# EAGLE board eib-256 (EAGLE 8.3.2), part 1 of 2
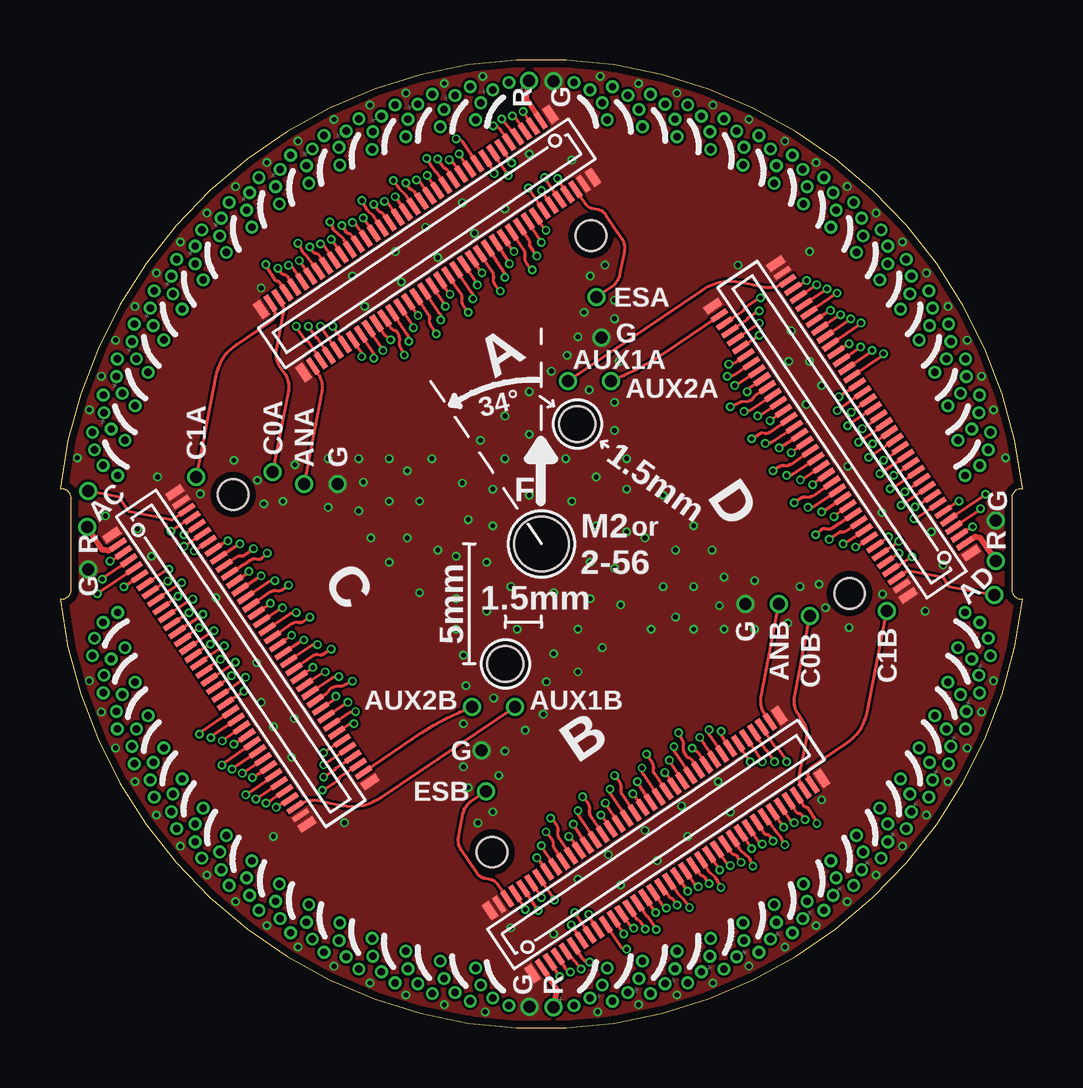
[diagram p1: board, top side]
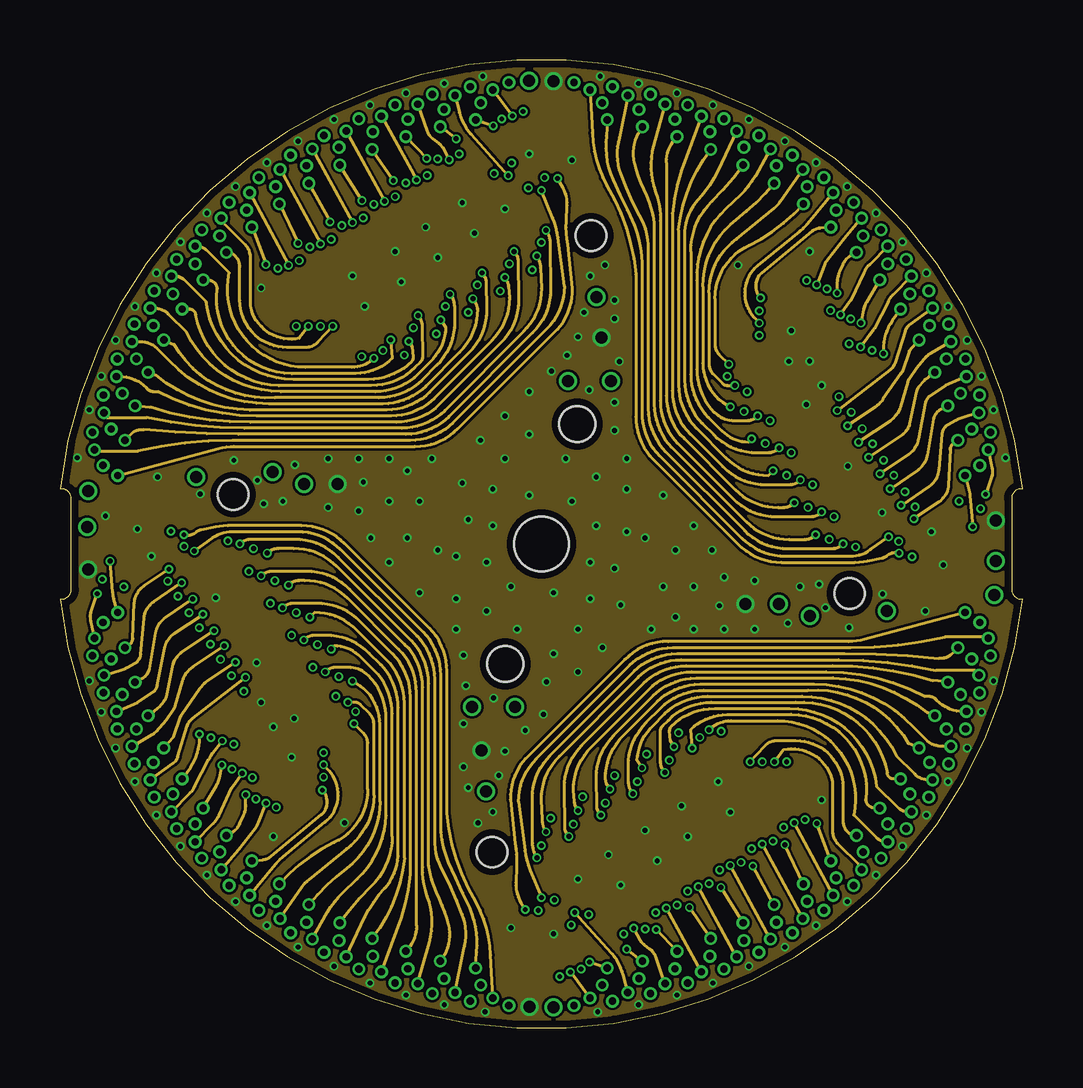
[diagram p2: board, inner layer Route2]
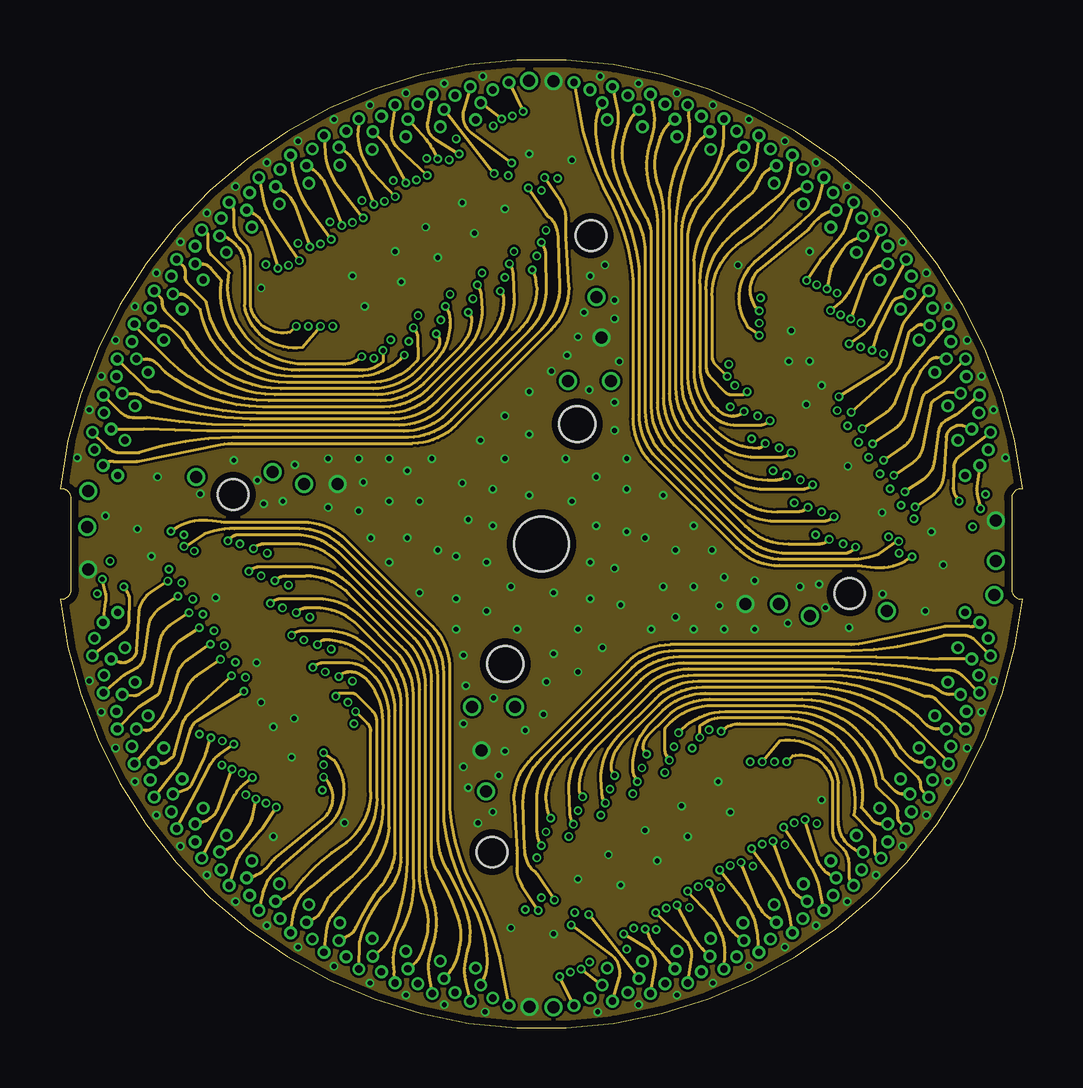
[diagram p3: board, inner layer Route15]
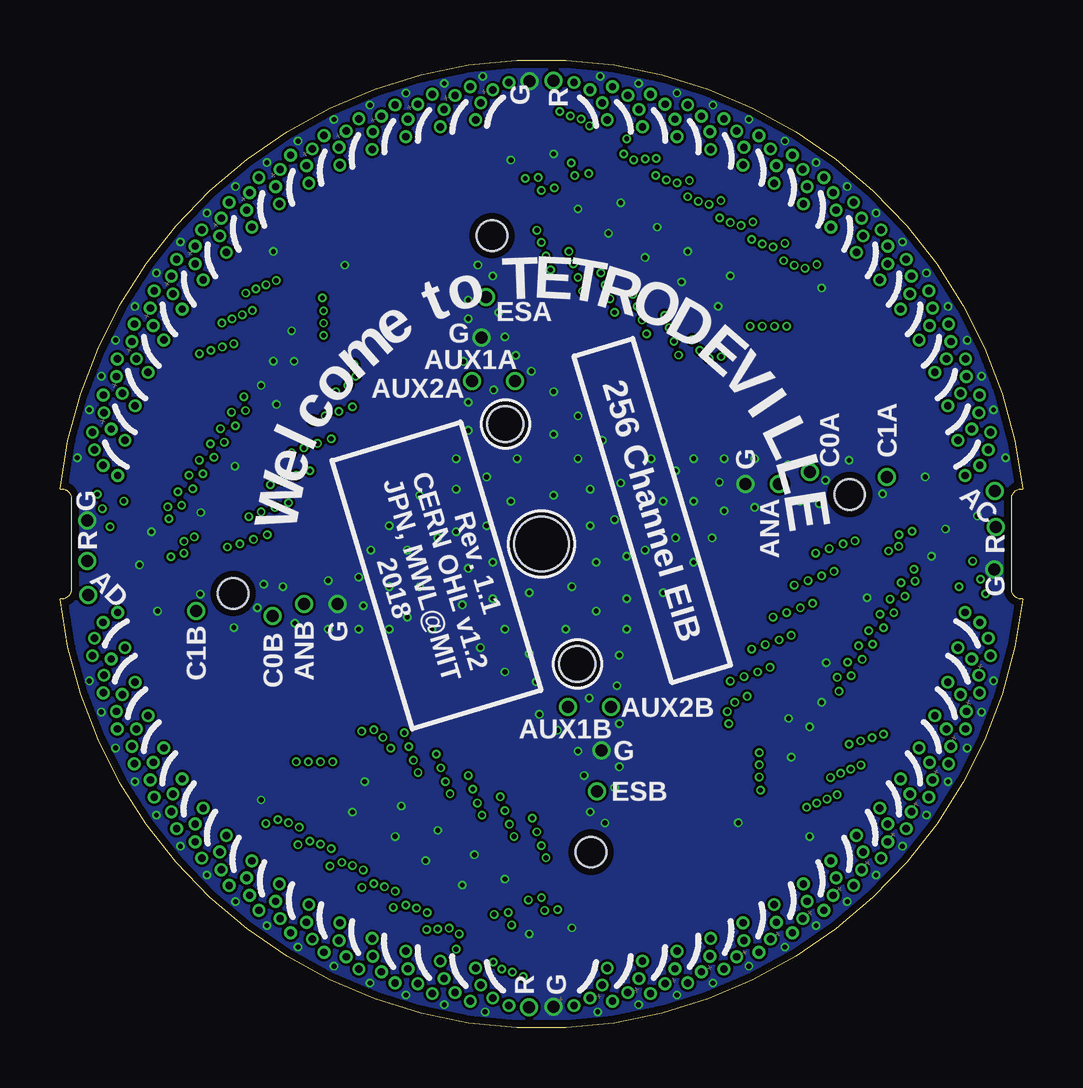
[diagram p4: board, bottom side, seen from below]

Size 40.14 x 40.35 mm. Coordinates in mm from the lower left corner, seen from the top.
Outline: 0,17.88 0.07,17.88 arc90 0.47,18.28 0.47,22.08 arc90 0.07,22.48 0,22.48 arc-167 40.14,22.48 40.07,22.48 arc90 39.67,22.08 39.67,18.28 arc90 40.07,17.88 40.14,17.88 arc-167 0,17.88
Copper layers (1+2*15+16): Top 0.035mm / dielectric 1.5mm / Route2 0.035mm / dielectric 0.15mm / Route15 0.035mm / dielectric 0.2mm / Bottom 0.035mm
Design rules "pcb-cart-standard-4-layer": minimum track width 3mil, minimum drill 6mil, track to track 4mil, track to pad 4mil, pad to pad 4mil, via to via 4mil, smd to smd 4mil, copper to edge 12mil, drill to drill 6mil, minimum pad ring 3mil, minimum via ring 3mil, stop-mask expansion 2mil, vias tented up to drill 20mil, thermal gap 10mil
Net classes: 1 thick: width 0.102 mm
Holes 1.27 mm at 22.13,33.02 32.92,18.12 18.01,7.33 7.22,22.23
tKeepout: area 0.2,0.3 to 39.9,40.1

## Footprints (pad centres in the part's own frame; a part is rotated, then mirrored left to right if it is on the bottom)
DF40-70HEAD = smd 0.23 x 0.75: 1 -6.8,-1.585; 2 -6.4,-1.585; 3 -6,-1.585; 4 -5.6,-1.585; 5 -5.2,-1.585; 6 -4.8,-1.585; 7 -4.4,-1.585; 8 -4,-1.585; 9 -3.6,-1.585; 10 -3.2,-1.585; 11 -2.8,-1.585; 12 -2.4,-1.585; 13 -2,-1.585; 14 -1.6,-1.585; 15 -1.2,-1.585; 16 -0.8,-1.585; 17 -0.4,-1.585; 18 0,-1.585; 19 0.4,-1.585; 20 0.8,-1.585; 21 1.2,-1.585; 22 1.6,-1.585; 23 2,-1.585; 24 2.4,-1.585; 25 2.8,-1.585; 26 3.2,-1.585; 27 3.6,-1.585; 28 4,-1.585; 29 4.4,-1.585; 30 4.8,-1.585; 31 5.2,-1.585; 32 5.6,-1.585; 33 6,-1.585; 34 6.4,-1.585; 35 6.8,-1.585; 36 6.8,1.585; 37 6.4,1.585; 38 6,1.585; 39 5.6,1.585; 40 5.2,1.585; 41 4.8,1.585; 42 4.4,1.585; 43 4,1.585; 44 3.6,1.585; 45 3.2,1.585; 46 2.8,1.585; 47 2.4,1.585; 48 2,1.585; 49 1.6,1.585; 50 1.2,1.585; 51 0.8,1.585; 52 0.4,1.585; 53 0,1.585; 54 -0.4,1.585; 55 -0.8,1.585; 56 -1.2,1.585; 57 -1.6,1.585; 58 -2,1.585; 59 -2.4,1.585; 60 -2.8,1.585; 61 -3.2,1.585; 62 -3.6,1.585; 63 -4,1.585; 64 -4.4,1.585; 65 -4.8,1.585; 66 -5.2,1.585; 67 -5.6,1.585; 68 -6,1.585; 69 -6.4,1.585; 70 -6.8,1.585 | smd 0.35 x 0.75: M1 -7.275,-1.585; M2 7.275,-1.585; M3 7.275,1.585; M4 -7.275,1.585
GOLDPIN_0.5ID_0.7OD = drill 0.5 pad 0.7: P$1 0,0
TETRODE_0.3ID_LINEAR = drill 0.305 pad 0.533: 0 2,17.78; 1 1.76,18.48; 2 1.23,19; 3 0.55,19.28
EIB_MOUNT_A = hole 2.261: 0,0 | hole 1.5: 1.5,5; -1.5,-5

## Placement (x,y rotation side)
A  DF40HEAD  [DF40-70HEAD]  15.3,32.7 214 top
AN_A  LRG_GP  [GOLDPIN_0.5ID_0.7OD]  10.17,22.68 34 top
AN_B  LRG_GP  [GOLDPIN_0.5ID_0.7OD]  29.97,17.68 0 top
AUXIN1_A  LRG_GP  [GOLDPIN_0.5ID_0.7OD]  21.17,26.98 0 top
AUXIN1_B  LRG_GP  [GOLDPIN_0.5ID_0.7OD]  18.97,13.38 0 top
AUXIN1_C  LRG_GP  [GOLDPIN_0.5ID_0.7OD]  1.17,22.38 0 top
AUXIN1_D  LRG_GP  [GOLDPIN_0.5ID_0.7OD]  38.96,18.04 0 top
AUXIN2_A  LRG_GP  [GOLDPIN_0.5ID_0.7OD]  22.97,26.98 0 top
AUXIN2_B  LRG_GP  [GOLDPIN_0.5ID_0.7OD]  17.17,13.38 0 top
B  DF40HEAD  [DF40-70HEAD]  24.84,7.65 34 top
C  DF40HEAD  [DF40-70HEAD]  7.54,15.4 304 top
CAT0_A  LRG_GP  [GOLDPIN_0.5ID_0.7OD]  8.87,23.18 34 top
CAT0_B  LRG_GP  [GOLDPIN_0.5ID_0.7OD]  31.27,17.18 0 top
CAT1_A  LRG_GP  [GOLDPIN_0.5ID_0.7OD]  5.67,22.98 34 top
CAT1_B  LRG_GP  [GOLDPIN_0.5ID_0.7OD]  34.47,17.38 0 top
D  DF40HEAD  [DF40-70HEAD]  32.6,24.95 124 top
ESTIM_A  LRG_GP  [GOLDPIN_0.5ID_0.7OD]  22.37,30.48 34 top
ESTIM_B  LRG_GP  [GOLDPIN_0.5ID_0.7OD]  17.76,9.87 0 top
GND0  LRG_GP  [GOLDPIN_0.5ID_0.7OD]  17.57,11.58 0 top
GND1  LRG_GP  [GOLDPIN_0.5ID_0.7OD]  11.57,22.68 0 top
GND2  LRG_GP  [GOLDPIN_0.5ID_0.7OD]  22.57,28.78 0 top
GND3  LRG_GP  [GOLDPIN_0.5ID_0.7OD]  28.57,17.68 0 top
REF_A  LRG_GP  [GOLDPIN_0.5ID_0.7OD]  19.56,39.48 0 top
REF_B  LRG_GP  [GOLDPIN_0.5ID_0.7OD]  20.58,0.87 0 top
REF_C  LRG_GP  [GOLDPIN_0.5ID_0.7OD]  1.13,20.89 0 top
REF_D  LRG_GP  [GOLDPIN_0.5ID_0.7OD]  39.01,19.46 0 top
SHLD_A  LRG_GP  [GOLDPIN_0.5ID_0.7OD]  20.57,39.48 34 top
SHLD_B  LRG_GP  [GOLDPIN_0.5ID_0.7OD]  19.57,0.88 0 top
SHLD_C  LRG_GP  [GOLDPIN_0.5ID_0.7OD]  1.18,19.11 0 top
SHLD_D  LRG_GP  [GOLDPIN_0.5ID_0.7OD]  39.01,21.16 0 top
TET0  0  [TETRODE_0.3ID_LINEAR]  20.07,20.18 357.6 bottom
TET1  1  [TETRODE_0.3ID_LINEAR]  20.07,20.18 352.8 bottom
TET2  2  [TETRODE_0.3ID_LINEAR]  20.07,20.18 348 bottom
TET3  3  [TETRODE_0.3ID_LINEAR]  20.07,20.18 343.2 bottom
TET4  4  [TETRODE_0.3ID_LINEAR]  20.07,20.18 338.4 bottom
TET5  5  [TETRODE_0.3ID_LINEAR]  20.07,20.18 333.6 bottom
TET6  6  [TETRODE_0.3ID_LINEAR]  20.07,20.18 328.8 bottom
TET7  7  [TETRODE_0.3ID_LINEAR]  20.07,20.18 324 bottom
TET8  8  [TETRODE_0.3ID_LINEAR]  20.07,20.18 319.2 bottom
TET9  9  [TETRODE_0.3ID_LINEAR]  20.07,20.18 314.4 bottom
TET10  10  [TETRODE_0.3ID_LINEAR]  20.07,20.18 309.6 bottom
TET11  11  [TETRODE_0.3ID_LINEAR]  20.07,20.18 304.8 bottom
TET12  12  [TETRODE_0.3ID_LINEAR]  20.07,20.18 300 bottom
TET13  13  [TETRODE_0.3ID_LINEAR]  20.07,20.18 295.2 bottom
TET14  14  [TETRODE_0.3ID_LINEAR]  20.07,20.18 290.4 bottom
TET15  15  [TETRODE_0.3ID_LINEAR]  20.07,20.18 285.6 bottom
TET16  16  [TETRODE_0.3ID_LINEAR]  20.07,20.18 105.6 top
TET17  17  [TETRODE_0.3ID_LINEAR]  20.07,20.18 110.4 top
TET18  18  [TETRODE_0.3ID_LINEAR]  20.07,20.18 115.2 top
TET19  19  [TETRODE_0.3ID_LINEAR]  20.07,20.18 120 top
TET20  20  [TETRODE_0.3ID_LINEAR]  20.07,20.18 124.8 top
TET21  21  [TETRODE_0.3ID_LINEAR]  20.07,20.18 129.6 top
TET22  22  [TETRODE_0.3ID_LINEAR]  20.07,20.18 134.4 top
TET23  23  [TETRODE_0.3ID_LINEAR]  20.07,20.18 139.2 top
TET24  24  [TETRODE_0.3ID_LINEAR]  20.07,20.18 144 top
TET25  25  [TETRODE_0.3ID_LINEAR]  20.07,20.18 148.8 top
TET26  26  [TETRODE_0.3ID_LINEAR]  20.07,20.18 153.6 top
TET27  27  [TETRODE_0.3ID_LINEAR]  20.07,20.18 158.4 top
TET28  28  [TETRODE_0.3ID_LINEAR]  20.07,20.18 163.2 top
TET29  29  [TETRODE_0.3ID_LINEAR]  20.07,20.18 168 top
TET30  30  [TETRODE_0.3ID_LINEAR]  20.07,20.18 172.8 top
TET31  31  [TETRODE_0.3ID_LINEAR]  20.07,20.18 177.6 top
TET32  32  [TETRODE_0.3ID_LINEAR]  20.07,20.18 177.6 bottom
TET33  33  [TETRODE_0.3ID_LINEAR]  20.07,20.18 172.8 bottom
TET34  34  [TETRODE_0.3ID_LINEAR]  20.07,20.18 168 bottom
TET35  35  [TETRODE_0.3ID_LINEAR]  20.07,20.18 163.2 bottom
TET36  36  [TETRODE_0.3ID_LINEAR]  20.07,20.18 158.4 bottom
TET37  37  [TETRODE_0.3ID_LINEAR]  20.07,20.18 153.6 bottom
TET38  38  [TETRODE_0.3ID_LINEAR]  20.07,20.18 148.8 bottom
TET39  39  [TETRODE_0.3ID_LINEAR]  20.07,20.18 144 bottom
TET40  40  [TETRODE_0.3ID_LINEAR]  20.07,20.18 139.2 bottom
TET41  41  [TETRODE_0.3ID_LINEAR]  20.07,20.18 134.4 bottom
TET42  42  [TETRODE_0.3ID_LINEAR]  20.07,20.18 129.6 bottom
TET43  43  [TETRODE_0.3ID_LINEAR]  20.07,20.18 124.8 bottom
TET44  44  [TETRODE_0.3ID_LINEAR]  20.07,20.18 120 bottom
TET45  45  [TETRODE_0.3ID_LINEAR]  20.07,20.18 115.2 bottom
TET46  46  [TETRODE_0.3ID_LINEAR]  20.07,20.18 110.4 bottom
TET47  47  [TETRODE_0.3ID_LINEAR]  20.07,20.18 105.6 bottom
TET48  48  [TETRODE_0.3ID_LINEAR]  20.07,20.18 285.6 top
TET49  49  [TETRODE_0.3ID_LINEAR]  20.07,20.18 290.4 top
TET50  50  [TETRODE_0.3ID_LINEAR]  20.07,20.18 295.2 top
TET51  51  [TETRODE_0.3ID_LINEAR]  20.07,20.18 300 top
TET52  52  [TETRODE_0.3ID_LINEAR]  20.07,20.18 304.8 top
TET53  53  [TETRODE_0.3ID_LINEAR]  20.07,20.18 309.6 top
TET54  54  [TETRODE_0.3ID_LINEAR]  20.07,20.18 314.4 top
TET55  55  [TETRODE_0.3ID_LINEAR]  20.07,20.18 319.2 top
TET56  56  [TETRODE_0.3ID_LINEAR]  20.07,20.18 324 top
TET57  57  [TETRODE_0.3ID_LINEAR]  20.07,20.18 328.8 top
TET58  58  [TETRODE_0.3ID_LINEAR]  20.07,20.18 333.6 top
TET59  59  [TETRODE_0.3ID_LINEAR]  20.07,20.18 338.4 top
TET60  60  [TETRODE_0.3ID_LINEAR]  20.07,20.18 343.2 top
TET61  61  [TETRODE_0.3ID_LINEAR]  20.07,20.18 348 top
TET62  62  [TETRODE_0.3ID_LINEAR]  20.07,20.18 352.8 top
TET63  63  [TETRODE_0.3ID_LINEAR]  20.07,20.18 357.6 top
U$1  [EIB_MOUNT_A]  20.07,20.18 0 top

## Tracks (layer width: path | path; a pad name or v marks a point on that pad's centre or on a via)
AN_A
  Top 0.127: A.36 10.75,27.29 arc-45 10.91,26.48 AN_A.P$1
AN_B
  Top 0.127: B.36 29.39,13.06 arc-45 29.23,13.87 AN_B.P$1
AUXIN1_A
  Top 0.127: D.34 30.18,31.04 arc-45 29.29,30.88 28.34,31.09 arc49 26.76,30.74 AUXIN1_A.P$1
AUXIN1_B
  Top 0.127: C.34 9.96,9.31 arc-45 10.85,9.47 11.8,9.26 arc49 13.38,9.61 AUXIN1_B.P$1
AUXIN1_C
  Top 0.127: C.69 4.65,21.17 2.87,21.52 2.46,22.13 AUXIN1_C.P$1
AUXIN1_D
  Top 0.127: D.69 35.34,19.08 36.8,18.8 37.06,18.41 AUXIN1_D.P$1
AUXIN2_A
  Top 0.127: D.36 25.04,28.03 arc-14 AUXIN2_A.P$1
AUXIN2_B
  Top 0.127: C.36 15.1,12.32 arc-14 AUXIN2_B.P$1
CAT0_A
  Top 0.127: A.34 9.21,30.28 arc-45 9.31,29.8 9.23,29.39 9.01,28.27 arc45 9.14,27.61 9.35,27.31 arc-45 9.51,26.49 CAT0_A.P$1
CAT0_B
  Top 0.127: B.34 30.93,10.07 arc-45 30.83,10.55 31.13,12.08 arc45 31,12.74 30.79,13.04 arc-45 30.63,13.86 CAT0_B.P$1
CAT1_A
  Top 0.127: A.35 8.88,30.05 arc-45 8.95,29.7 8.95,29.69 arc-45 8.8,29.46 7.36,28.49 arc45 6.48,27.17 CAT1_A.P$1
CAT1_B
  Top 0.127: B.35 31.26,10.3 arc-45 31.19,10.65 31.19,10.66 arc-45 31.34,10.89 32.78,11.86 arc45 33.65,13.18 CAT1_B.P$1
ESTIM_A
  Top 0.127: A.69 21.9,34.35 arc45 22.18,34.17 22.43,34.12 arc-45 22.74,33.91 23.42,32.92 arc-45 23.52,32.39 23.33,31.4 arc-45 23,30.9 ESTIM_A.P$1
ESTIM_B
  Top 0.127: B.69 18.24,6 arc45 17.96,6.18 17.71,6.23 arc-45 17.39,6.44 16.72,7.43 arc-45 16.62,7.96 16.81,8.95 arc-45 17.14,9.45 ESTIM_B.P$1
GND  (via drill 0.2)
  other vias: 12.96,20.43 13.72,23.73 13.72,21.95 13.72,19.41 14.48,20.43 14.99,21.95 15.5,23.73 14.99,18.14 15.75,19.92 16.77,22.72 17.53,24.49 18.55,25.51 19.56,24.75 18.55,23.73 18.04,22.46 17.02,21.19 16.51,19.67 16.51,17.89 17.78,17.38 19.05,16.62 18.8,18.4 16.51,16.62 16.82,15.54 16.92,14.27 18.08,13.76 16.82,10.89 17.02,10.02 17.42,8.55 18.04,9.01 18.29,10.52 18.55,11.54 19.4,12.41 20.15,13.07 17.78,19.41 18.04,20.94 14.48,23.22 19.56,22.21 8.89,7.98 8.39,30.84 34.29,18.09 31.91,17.52 30.85,18.4 30.34,16.88 28.96,16.62 28.96,18.65 27.69,16.62 27.69,18.8 27.18,19.92 26.42,16.62 26.42,18.4 26.42,20.94 25.66,19.92 25.15,18.4 24.64,16.62 25.15,22.21 24.39,20.43 23.37,17.64 22.61,15.86 21.59,14.84 20.28,14.43 20.58,15.6 21.59,16.62 22.1,17.89 23.12,19.16 23.63,20.68 23.63,22.46 22.36,22.97 21.09,23.73 21.34,21.95 23.63,23.73 22.36,20.94 22.1,19.41 25.66,17.13 20.58,18.14 36.07,17.38 31.25,32.37 31.75,9.51 3.81,19.67 8.39,13.57 8.89,12.56 18.8,4.17 21.59,6.21 22.86,7.22 24.39,8.24 25.91,9.25 27.44,10.27 27.94,9 26.17,7.98 24.9,6.97 23.37,5.95 20.58,3.92 9.66,11.29 36.33,20.68 36.82,19.3 31.75,26.78 31.25,27.8 21.34,36.18 18.55,34.15 17.28,33.13 15.75,32.11 14.23,31.1 12.7,30.08 12.2,31.35 13.97,32.37 15.24,33.38 16.77,34.4 19.56,36.43 30.48,29.07 27.49,17.6 32.89,16.69 31.65,18.5 19.56,26.53 23.12,24.91 23.12,26.08 22.06,26.6 23.12,29.57 23.12,30.34 22.72,31.81 22.1,31.34 21.85,29.83 21.59,28.81 21.14,28.04 20.49,27.38 5.85,22.26 8.23,22.83 9.29,21.95 9.8,23.48 11.18,23.73 11.18,21.7 12.45,23.73 12.45,21.55 4.07,22.97 12.65,22.75 7.25,23.66 8.49,21.85 1.22,14.47 1.72,13.17 2.32,11.67 3.12,10.27 4.02,8.87 5.02,7.57 6.12,6.37 7.32,5.27 8.62,4.27 9.92,3.37 11.42,2.57 12.92,1.87 14.42,1.37 16.02,0.97 17.72,0.67 0.72,23.77 1.22,25.77 1.72,27.17 2.32,28.67 3.12,30.07 4.02,31.47 5.02,32.77 6.12,33.97 7.32,35.07 8.62,36.07 9.92,36.97 11.42,37.87 12.92,38.47 14.42,38.97 16.02,39.37 17.62,39.67 38.92,14.47 38.42,13.17 37.82,11.67 37.02,10.27 36.12,8.87 35.12,7.57 34.02,6.37 32.82,5.27 31.52,4.27 30.22,3.37 28.72,2.57 27.22,1.87 25.72,1.37 24.12,0.97 22.42,0.67 39.42,23.77 38.92,25.77 38.42,27.17 37.82,28.67 37.02,30.07 36.12,31.47 35.12,32.77 34.02,33.97 32.82,35.07 31.52,36.07 30.22,36.97 28.72,37.87 27.22,38.47 25.72,38.97 24.12,39.37 22.52,39.67 16.82,12.69 23.32,27.78 9.76,12.9 6.49,17.93 8.2,15.22 3.23,20.8 1.9,21.35 11.86,8.55 28.27,31.8 30.38,27.79 31.11,25.99 32.84,23.42 34.27,21.49
  pour Bottom (no thermals): -4.93,45.18 45.07,45.18 45.07,-4.82 -4.93,-4.82
  pour Top (no thermals): -7.93,48.18 48.07,48.18 48.07,-7.82 -7.93,-7.82
  pour Route15 (no thermals): -5.93,46.18 46.07,46.18 46.07,-5.82 -5.93,-5.82
  pour Route2 (no thermals): -6.93,47.18 47.07,47.18 47.07,-6.82 -6.93,-6.82
N$1  (via drill 0.2)
  Top 0.127: D.2 38.04,20.9 v38.05,20.89
  Route2 0.127: TET48.0 37.89,22.44 arc-10 37.94,22.19 v38.05,20.89
N$2  (via drill 0.2)
  Top 0.127: D.3 38.29,21.55 v38.38,21.65
  Route15 0.127: TET48.1 38.22,22.57 arc22 38.25,22.17 v38.38,21.65
N$3  (via drill 0.2)
  Top 0.127: D.4 v38.59,22.24 v38.59,22.25
  Route2 0.127: TET48.2 38.85,23.37 arc-31 38.82,22.94 v38.59,22.25
N$4  (via drill 0.2)
  Top 0.127: D.5 v37.47,21.97 v37.48,21.96
  Route15 0.127: TET48.3 37.47,23.82 arc51 37.25,23.38 37.23,22.52 arc35 37.34,22.17 v37.48,21.96
N$5  (via drill 0.2)
  Top 0.127: D.6 35.62,21.2 v35.6,21.23
  Route2 0.127: TET49.0 37.3,24.42 arc58 37.1,24.11 37.04,22.64 arc-53 36.64,21.93 v35.6,21.23
N$6  (via drill 0.2)
  Top 0.127: D.7 35.66,21.71 v35.65,21.72
  Route15 0.127: TET49.1 37.66,25.09 arc51 37.28,25.06 37.16,24.99 arc56 36.94,24.62 36.84,23.03 arc-52 36.37,22.21 v35.65,21.72
N$7  (via drill 0.2)
  Top 0.127: D.8 v35.07,21.79
  Route2 0.127: TET49.2 37.59,25.43 arc13 37.34,25.33 37,25.14 arc56 36.77,24.78 36.63,23.27 arc-51 36.22,22.57 v35.07,21.79
N$8  (via drill 0.2)
  Top 0.127: D.9 35.21,22.37 v35.22,22.35
  Route15 0.127: TET49.3 37.47,25.64 arc-12 37.33,25.55 36.96,25.35 arc54 36.61,24.84 36.44,23.61 arc-48 35.99,22.87 v35.22,22.35
N$9  (via drill 0.2)
  Top 0.127: D.10 34.62,22.45 v34.6,22.47
  Route2 0.127: TET50.0 36.69,25.76 arc52 36.41,25.38 36.15,23.88 arc-46 35.73,23.23 v34.6,22.47
N$10  (via drill 0.2)
  Top 0.127: D.11 35.47,23.52 v34.76,23.04
  Route15 0.127: TET50.1 37.08,26.49 arc38 36.83,26.43 36.45,26.18 arc47 36.29,25.96 35.96,24.19 arc-45 35.56,23.57 v34.76,23.04
N$11  (via drill 0.2)
  Top 0.127: D.12 35.25,23.83 v34.18,23.1
  Route2 0.127: TET50.2 36.91,26.78 36.26,26.35 arc45 36.08,26.08 35.78,24.52 arc-45 35.38,23.92 v34.18,23.1
N$12  (via drill 0.2)
  Top 0.127: D.13 35.02,24.13 v34.33,23.67
  Route15 0.127: TET50.3 36.85,26.98 36.1,26.49 arc42 35.95,26.28 35.55,24.77 arc-41 35.16,24.23 v34.33,23.67
N$13  (via drill 0.2)
  Top 0.127: D.14 34.79,24.51 v33.72,23.79
  Route2 0.127: TET51.0 36.1,27.05 arc12 36.01,26.97 35.79,26.71 arc29 35.7,26.54 35.41,25.18 arc-44 35.1,24.72 v33.72,23.79
N$14  (via drill 0.2)
  Top 0.127: D.15 34.58,24.83 v33.87,24.35
  Route15 0.127: TET51.1 36.58,27.94 arc56 36.23,27.8 35.92,27.43 arc14 35.86,27.35 35.58,26.8 arc12 35.52,26.63 35.24,25.6 arc-41 34.8,24.98 v33.87,24.35
N$15  (via drill 0.2)
  Top 0.127: D.16 34.35,25.14 v33.29,24.42
  Route2 0.127: TET51.2 36.29,28.12 arc19 36.12,27.98 35.72,27.52 35.4,27.06 arc19 35.34,26.94 35.03,25.89 arc-40 34.61,25.31 v33.29,24.42
N$16  (via drill 0.2)
  Top 0.127: D.17 34.12,25.44 v33.45,24.99
  Route15 0.127: TET51.3 35.98,28.1 35.25,27.17 arc17 35.18,27.06 34.83,26.16 arc-35 34.43,25.65 v33.45,24.99
N$17  (via drill 0.2)
  Top 0.127: v32.83,25.11 D.18
  Route2 0.127: TET52.0 35.4,28.22 35.11,27.37 arc-16 35.06,27.27 34.31,26.21 arc-21 33.98,25.88 v32.83,25.11 | v32.83,25.11
N$18  (via drill 0.2)
  Top 0.127: v32.98,25.67 D.19
  Route15 0.127: TET52.1 35.94,29.31 arc43 35.69,29.25 35.46,29.08 arc38 35.37,28.95 35.02,27.66 arc-33 34.78,27.28 v32.98,25.67
N$19  (via drill 0.2)
  Top 0.127: v32.4,25.74 D.20
  Route2 0.127: TET52.2 35.39,29.29 arc37 35.23,29.06 34.83,27.76 arc-35 34.61,27.44 v32.4,25.74
N$20  (via drill 0.2)
  Top 0.127: v32.47,26.32 D.21
  Route15 0.127: TET52.3 35.19,29.41 arc21 35.1,29.23 34.68,27.9 arc-41 34.4,27.53 v32.47,26.32
N$21  (via drill 0.2)
  Top 0.127: D.22 34.36,28.07 v34.33,28.11
  Route2 0.127: TET53.0 34.7,29.49 arc37 34.32,28.26 v34.33,28.11
N$22  (via drill 0.2)
  Top 0.127: D.23 33.87,28.22 v33.85,28.25
  Route15 0.127: TET53.1 34.9,30.41 arc45 34.64,30.18 34.14,29.12 arc9 34.02,28.82 v33.85,28.25
N$23  (via drill 0.2)
  Top 0.127: D.24 33.38,28.37 v33.37,28.38
  Route2 0.127: TET53.2 34.71,30.55 arc17 34.52,30.29 33.94,29.16 arc-10 33.77,28.89 v33.37,28.38
N$24  (via drill 0.2)
  Top 0.127: D.25 v32.9,28.53 v32.9,28.52
  Route15 0.127: TET53.3 34.47,30.51 arc0 34.47,30.5 33.85,29.35 arc-26 33.52,28.97 v32.9,28.52
N$25  (via drill 0.2)
  Top 0.127: D.26 33.41,29.36 v33.39,29.39
  Route2 0.127: TET54.0 33.61,30.24 arc20 33.49,29.93 v33.39,29.39
N$26  (via drill 0.2)
  Top 0.127: D.27 32.97,29.55 v32.96,29.56
  Route15 0.127: TET54.1 34.22,31.77 arc38 33.66,31.4 arc17 33.52,31.13 v32.96,29.56
N$27  (via drill 0.2)
  Top 0.127: D.28 v32.54,29.74
  Route2 0.127: TET54.2 33.75,31.83 arc20 33.51,31.49 32.98,30.34 v32.54,29.74
N$28  (via drill 0.2)
  Top 0.127: D.29 32.11,29.92 v32.12,29.91
  Route15 0.127: TET54.3 33.49,31.82 32.84,30.62 arc-23 32.51,30.23 v32.12,29.91
N$29  (via drill 0.2)
  Top 0.127: D.30 31.23,29.85 v32.39,30.63
  Route2 0.127: TET55.0 32.97,32.2 arc37 32.64,31.85 32.5,31.52 arc25 32.39,31.05 v32.39,30.63
N$30  (via drill 0.2)
  Top 0.127: D.31 v31.97,30.81
  Route15 0.127: TET55.1 33.18,32.9 arc36 32.65,32.48 32.23,31.83 arc22 32.11,31.54 v31.97,30.81
N$31  (via drill 0.2)
  Top 0.127: D.32 30.8,30.47 v31.55,30.98
  Route2 0.127: TET55.2 32.7,32.91 32,32.03 arc17 31.86,31.79 v31.55,30.98
N$32  (via drill 0.2)
  Top 0.127: D.42 28.09,27.22 arc-45 v27.82,27.16
  Route15 0.127: v27.82,27.16 27.31,27.67 arc-45 27.18,27.98 27.18,30.53 arc-57 28.39,32.75 arc20 30.29,34.53 arc-44 TET57.1 | v27.82,27.16
N$33  (via drill 0.2)
  Top 0.127: D.43 28.15,26.78 v28.13,26.78
  Route2 0.127: v28.13,26.78 27.82,26.78 arc-45 27.63,26.86 27.22,27.27 arc-45 27.05,27.67 27.05,30.65 arc-54 28.2,32.88 29.77,34.17 arc16 30.04,34.46 TET57.2 | v28.13,26.78
N$34  (via drill 0.2)
  Top 0.127: D.44 28.69,26.66 v28.64,26.53
  Route15 0.127: v28.64,26.53 arc-63 28.44,26.4 27.98,26.4 arc-45 27.75,26.5 27.12,27.13 arc-45 26.93,27.58 26.93,30.78 arc-51 28.01,33.07 29.67,34.46 30.08,34.82 arc26 30.43,35.71 TET57.3
N$35  (via drill 0.2)
  Top 0.127: D.45 29.03,26.4 arc17 28.99,26.37 28.86,26.21 arc-31 28.8,26.16 28.64,26.1 arc-22 28.62,26.1 28.43,26.1 arc27 28.38,26.09 28.06,25.93 v27.94,25.89
  Route2 0.127: TET58.0 arc-14 28.2,33.7 arc53 26.8,30.91 26.8,27.7 arc64 v27.94,25.89
N$36  (via drill 0.2)
  Top 0.127: D.46 28.78,25.75 arc-45 v28.51,25.7
  Route15 0.127: v28.51,25.7 arc-45 28.06,25.51 28.05,25.51 arc-45 27.42,25.77 arc-45 26.67,27.57 26.67,31.03 arc-46 27.94,34.02 28.71,34.66 arc30 29.14,35.29 arc-45 29.64,35.84 TET58.1
N$37  (via drill 0.2)
  Top 0.127: D.47 29.13,25.5 v29.09,25.51
  Route2 0.127: TET58.2 28.98,35.51 arc-18 28.35,34.71 27.75,34.15 arc50 26.55,31.16 26.55,27.45 arc45 27.29,25.66 arc45 28.11,25.32 28.63,25.32 arc45 v29.09,25.51
N$38  (via drill 0.2)
  Top 0.127: D.48 29.67,25.39 v29.59,25.32
  Route15 0.127: v29.59,25.32 arc-45 29.13,25.13 28.19,25.13 arc-45 27.16,25.56 arc-45 26.42,27.35 26.42,31.99 arc-44 27.63,34.27 28.45,35.22 28.78,35.63 arc31 29,36.15 TET58.3
N$39  (via drill 0.2)
  Top 0.127: D.49 29.57,24.82 arc-46 29.39,24.78 29.3,24.8 arc43 29.2,24.78 v28.84,24.56 v28.83,24.56
  Route2 0.127: TET59.0 arc-11 27.18,34.46 arc46 26.29,32.37 26.29,27.25 arc45 27.04,25.45 27.6,24.89 arc45 28.71,24.43 v28.83,24.56
N$40  (via drill 0.2)
  Top 0.127: D.50 29.67,24.42 arc-45 v29.4,24.37
  Route15 0.127: v29.4,24.37 29.29,24.25 arc-45 29.11,24.18 arc-45 27.31,24.92 26.91,25.32 arc-45 26.17,27.12 26.17,33.07 arc-33 26.74,34.4 arc13 27.79,36.13 arc-47 28.21,36.55 TET59.1
N$41  (via drill 0.2)
  Top 0.127: D.51 30.04,24.19 arc-45 v29.98,24.18
  Route2 0.127: v29.98,24.18 arc-45 29.52,23.99 29.05,23.99 arc-45 27.25,24.73 26.78,25.2 arc-45 26.04,26.99 26.04,33.19 arc-40 26.61,34.53 arc18 27.44,35.75 TET59.2
N$42  (via drill 0.2)
  Top 0.127: D.52 30.56,24.06 v30.48,23.99
  Route15 0.127: v30.48,23.99 arc-45 30.02,23.79 29.01,23.79 arc-45 27.22,24.54 26.66,25.1 arc-45 25.91,26.89 25.91,33.26 arc-43 26.48,34.65 arc35 27.64,36.75 TET59.3
N$43  (via drill 0.2)
  Top 0.127: D.53 30.47,23.5 arc-46 30.19,23.44 arc43 29.98,23.4 29.72,23.24 v29.72,23.22
  Route2 0.127: TET60.0 arc32 25.78,33.26 25.78,26.8 arc45 26.53,25 27.77,23.76 arc45 29.53,23.03 v29.72,23.22
N$44  (via drill 0.2)
  Top 0.127: D.54 30.55,23.09 arc-45 v30.29,23.03
  Route15 0.127: v30.29,23.03 arc-45 29.83,22.84 29.49,22.84 arc-45 27.7,23.59 26.4,24.88 arc-45 25.66,26.68 25.66,33.45 arc-19 26.24,36.28 26.41,36.61 arc-27 26.97,37.26 TET60.1
N$45  (via drill 0.2)
  Top 0.127: D.55 30.92,22.85 arc-45 v30.86,22.84
  Route2 0.127: v30.86,22.84 arc-45 30.4,22.65 29.43,22.65 arc-45 27.63,23.4 26.27,24.75 arc-45 25.53,26.55 25.53,33.95 arc-17 26.11,36.33 TET60.2
N$46  (via drill 0.2)
  Top 0.127: D.56 31.45,22.73 v31.37,22.65
  Route15 0.127: v31.37,22.65 arc-45 30.91,22.46 29.39,22.46 arc-45 27.59,23.21 26.15,24.65 arc-45 25.4,26.44 25.4,34.15 arc-31 25.97,36.43 arc42 26.2,38.04 TET60.3
N$47  (via drill 0.2)
  Top 0.127: D.57 31.38,22.18 arc-46 31.09,22.12 arc43 30.86,22.08 30.62,21.93 v30.61,21.89
  Route2 0.127: v30.61,21.89 arc-45 30.15,21.7 29.94,21.7 arc-45 28.14,22.44 26.02,24.56 arc-45 25.28,26.36 25.28,36.07 arc-45 TET61.0
N$48  (via drill 0.2)
  Top 0.127: D.58 31.32,21.67 v31.18,21.7
  Route15 0.127: v31.18,21.7 arc-45 30.72,21.51 29.9,21.51 arc-45 28.1,22.25 25.89,24.46 arc-45 25.15,26.26 25.15,34.02 arc21 24.96,35.03 arc-38 24.9,36.74 24.98,37.02 arc-40 TET61.1
N$49  (via drill 0.2)
  Top 0.127: D.59 31.78,21.5 v31.75,21.51
  Route2 0.127: v31.75,21.51 arc-45 31.29,21.32 29.86,21.32 arc-45 28.06,22.06 25.77,24.36 arc-45 25.02,26.15 25.02,33.64 arc24 24.83,34.84 arc-36 24.74,36.79 TET61.2
N$50  (via drill 0.2)
  Top 0.127: D.60 32.34,21.4 v32.26,21.32
  Route15 0.127: v32.26,21.32 arc-45 31.8,21.13 29.84,21.13 arc-45 28.04,21.87 25.64,24.27 arc-45 24.9,26.07 24.9,33.64 arc18 24.64,34.84 arc-38 24.57,36.81 24.68,37.18 arc27 24.74,38.24 TET61.3
N$51  (via drill 0.2)
  Top 0.127: D.61 32.2,20.84 arc-44 31.97,20.79 31.89,20.81 arc48 31.71,20.77 31.51,20.62 v31.5,20.56
  Route2 0.127: v31.5,20.56 arc-45 31.04,20.37 30.39,20.37 arc-45 28.6,21.11 25.51,24.19 arc-45 24.77,25.99 24.77,33.57 arc18 24.32,34.97 arc-15 23.94,36.05 arc-49 TET62.0
N$52  (via drill 0.2)
  Top 0.127: D.62 32.74,20.71 arc-45 32.58,20.67 32.57,20.67 arc45 32.47,20.65 32.07,20.38 v32.07,20.37
  Route15 0.127: v32.07,20.37 arc-45 31.61,20.18 30.37,20.18 arc-45 28.57,20.92 25.39,24.1 arc-45 24.64,25.9 24.64,33.19 arc20 24.39,33.89 arc-11 23.56,35.67 arc-34 23.5,37.09 23.51,37.15 arc-38 TET62.1
N$53  (via drill 0.2)
  Top 0.127: D.63 32.67,20.17 v32.64,20.18
  Route2 0.127: v32.64,20.18 arc-45 32.18,19.99 30.34,19.99 arc-45 28.54,20.73 25.26,24.01 arc-45 24.51,25.81 24.51,32.43 arc32 24.13,33.89 arc-8 23.37,35.61 arc-38 23.32,37.12 TET62.2
N$54  (via drill 0.2)
  Top 0.127: D.64 33.23,20.07 v33.16,20.05
  Route15 0.127: v33.16,20.05 arc-45 32.75,19.79 30.31,19.79 arc-45 28.51,20.54 25.13,23.92 arc-45 24.39,25.71 24.39,32.3 arc34 23.88,33.95 arc-12 23.18,35.54 arc-37 23.14,37.14 23.23,37.58 arc24 23.23,38.33 TET62.3
N$55  (via drill 0.2)
  Top 0.127: v34.54,20.47 D.65
  Route2 0.127: v34.54,20.47 33.79,19.94 arc-35 32.94,19.67 30.23,19.67 arc-45 28.44,20.41 25,23.84 arc-45 24.26,25.64 24.26,31.86 arc22 23.94,33.45 arc0 23.05,35.35 arc-31 22.77,37.19 TET63.0
N$56  (via drill 0.2)
  Top 0.127: v34.97,20.28 D.66
  Route15 0.127: TET63.1 arc33 22.32,37.52 22.33,37.28 arc23 22.93,35.22 arc-23 24.13,31.73 24.13,25.56 arc45 24.88,23.76 28.36,20.28 arc45 30.15,19.54 32.86,19.54 arc24 34.13,19.77 34.91,20.29 v34.97,20.28
N$57  (via drill 0.2)
  Top 0.127: v34.97,19.79 D.67
  Route2 0.127: v34.97,19.79 34.87,19.81 arc45 34.58,19.75 34.47,19.68 arc-22 34.25,19.59 33.66,19.47 arc-12 33.14,19.41 30.07,19.41 arc-45 28.27,20.16 24.75,23.68 arc-45 24.01,25.48 24.01,31.41 arc26 22.8,35.1 arc-27 22.19,37.31 TET63.2
N$58  (via drill 0.2)
  Top 0.127: v35.52,19.65 35.39,19.56 34.68,19.08 D.68
  Route15 0.127: TET63.3 21.81,37.33 arc10 22.67,34.97 arc-26 23.88,31.22 23.88,25.39 arc45 24.62,23.59 28.19,20.02 arc45 29.99,19.28 33.14,19.28 arc-8 33.42,19.26 33.79,19.21 33.99,19.19 arc39 35.39,19.56 v35.52,19.65
N$59  (via drill 0.2)
  Top 0.127: D.41 28.12,27.72 arc-45 v27.88,27.67
  Route2 0.127: v27.88,27.67 27.48,28.07 arc-45 27.31,28.48 27.31,30.4 arc-64 28.71,32.62 arc23 TET57.0
N$60  (via drill 0.2)
  Top 0.127: v29.15,28.87 28.4,28.37 D.40
  Route15 0.127: TET56.3 31.67,34.73 arc-7 31.63,34.6 31.53,34.34 arc-28 31.23,33.9 30.86,33.57 29,31.96 arc83 28.65,29.28 28.71,29.19 v29.15,28.87
N$61  (via drill 0.2)
  Top 0.127: v29.15,29.38 D.39
  Route2 0.127: TET56.2 31.26,33.64 arc-11 30.83,33.22 29.08,31.77 arc93 28.93,29.63 v29.15,29.38
N$62  (via drill 0.2)
  Top 0.127: D.38 28.66,29.53 28.67,29.57 v29.14,29.89 v29.15,29.89
  Route15 0.127: TET56.1 arc42 31.47,33.6 31.29,33.39 arc-11 31.14,33.24 29.18,31.64 arc99 v29.15,29.89
N$63  (via drill 0.2)
  Top 0.127: D.33 30.6,30.8 v31.12,31.15
  Route15 0.127: TET55.3 32.79,33.51 arc-26 32.56,33.01 31.77,32.12 arc8 31.69,32.01 v31.12,31.15
N$64  (via drill 0.2)
  Top 0.127: D.37 28.5,29.91 28.52,30.01 29.11,30.41 v29.2,30.43
  Route2 0.127: TET56.0 31.69,33.34 arc31 31.35,33.21 29.23,31.46 arc92 v29.2,30.43
N$65  (via drill 0.2)
  Top 0.127: C.3 1.85,18.8 v1.76,18.7
  Route15 0.127: TET16.1 1.91,17.78 arc22 1.89,18.18 v1.76,18.7
N$66  (via drill 0.2)
  Top 0.127: C.2 2.1,19.45 v2.09,19.46
  Route2 0.127: TET16.0 2.25,17.91 arc-10 2.2,18.16 v2.09,19.46
N$67  (via drill 0.2)
  Top 0.127: C.32 9.34,9.88 v8.59,9.37
  Route2 0.127: TET23.2 7.44,7.44 8.14,8.32 arc17 8.27,8.56 v8.59,9.37
N$68  (via drill 0.2)
  Top 0.127: C.33 9.54,9.55 v9.02,9.2
  Route15 0.127: TET23.3 7.35,6.84 arc-26 7.58,7.34 8.37,8.23 arc8 8.45,8.34 v9.02,9.2
N$69  (via drill 0.2)
  Top 0.127: C.28 v7.6,10.62
  Route2 0.127: TET22.2 6.39,8.52 arc20 6.63,8.86 7.16,10.01 v7.6,10.62
N$70  (via drill 0.2)
  Top 0.127: C.29 8.03,10.43 v8.02,10.44
  Route15 0.127: TET22.3 6.65,8.53 7.3,9.74 arc-23 7.63,10.12 v8.02,10.44
N$71  (via drill 0.2)
  Top 0.127: C.24 6.76,11.98 v6.76,11.97
  Route2 0.127: TET21.2 5.43,9.8 arc17 5.62,10.06 6.2,11.19 arc-10 6.37,11.46 v6.76,11.97
N$72  (via drill 0.2)
  Top 0.127: C.25 v7.24,11.82 v7.24,11.83
  Route15 0.127: TET21.3 5.67,9.84 arc0 5.67,9.85 6.28,11 arc-26 6.61,11.38 v7.24,11.83
N$73  (via drill 0.2)
  Top 0.127: v7.74,14.61 C.20
  Route2 0.127: TET20.2 4.75,11.06 arc37 4.91,11.29 5.31,12.59 arc-35 5.53,12.91 v7.74,14.61
N$74  (via drill 0.2)
  Top 0.127: v7.67,14.03 C.21
  Route15 0.127: TET20.3 4.95,10.95 arc21 5.04,11.12 5.45,12.45 arc-41 5.74,12.83 v7.67,14.03
N$75  (via drill 0.2)
  Top 0.127: C.16 5.79,15.21 v6.85,15.93
  Route2 0.127: TET19.2 3.85,12.23 arc19 4.01,12.37 4.42,12.83 4.74,13.29 arc19 4.8,13.41 5.11,14.46 arc-40 5.53,15.04 v6.85,15.93
N$76  (via drill 0.2)
  Top 0.127: C.17 6.02,14.91 v6.69,15.37
  Route15 0.127: TET19.3 4.16,12.25 4.89,13.18 arc17 4.96,13.29 5.31,14.19 arc-35 5.71,14.7 v6.69,15.37
N$77  (via drill 0.2)
  Top 0.127: C.12 4.89,16.52 v5.96,17.25
  Route2 0.127: TET18.2 3.23,13.57 3.88,14 arc45 4.06,14.27 4.36,15.83 arc-45 4.76,16.43 v5.96,17.25
N$78  (via drill 0.2)
  Top 0.127: C.13 5.12,16.22 v5.81,16.68
  Route15 0.127: TET18.3 3.29,13.37 4.04,13.86 arc42 4.19,14.07 4.59,15.58 arc-41 4.98,16.12 v5.81,16.68
N$79  (via drill 0.2)
  Top 0.127: C.8 v5.07,18.56
  Route2 0.127: TET17.2 2.55,14.92 arc13 2.8,15.02 3.13,15.21 arc56 3.37,15.57 3.51,17.09 arc-51 3.92,17.78 v5.07,18.56
N$80  (via drill 0.2)
  Top 0.127: C.9 4.93,17.98 v4.92,18
  Route15 0.127: TET17.3 2.67,14.71 arc-12 2.81,14.8 3.18,15 arc54 3.53,15.51 3.69,16.74 arc-48 4.15,17.48 v4.92,18
N$81  (via drill 0.2)
  Top 0.127: v5.17,20.07 C.66
  Route15 0.127: TET31.1 arc33 17.82,2.84 17.81,3.07 arc23 17.21,5.13 arc-23 16.01,8.62 16.01,14.79 arc45 15.26,16.59 11.78,20.07 arc45 9.98,20.81 7.28,20.81 arc24 6.01,20.58 5.23,20.06 v5.17,20.07
N$82  (via drill 0.2)
  Top 0.127: v5.6,19.88 C.65
  Route2 0.127: v5.6,19.88 6.35,20.42 arc-35 7.2,20.68 9.91,20.68 arc-45 11.7,19.94 15.13,16.51 arc-45 15.88,14.71 15.88,8.49 arc22 16.2,6.9 arc0 17.09,5 arc-31 17.36,3.16 TET31.0
N$83  (via drill 0.2)
  Top 0.127: C.62 7.4,19.65 arc-45 7.56,19.68 7.57,19.68 arc45 7.66,19.7 8.06,19.97 v8.07,19.99
  Route15 0.127: v8.07,19.99 arc-45 8.53,20.18 9.77,20.18 arc-45 11.57,19.43 14.75,16.25 arc-45 15.5,14.45 15.5,7.16 arc20 15.75,6.46 arc-11 16.58,4.68 arc-34 16.64,3.26 16.63,3.2 arc-38 TET30.1
N$84  (via drill 0.2)
  Top 0.127: C.64 6.91,20.28 v7,20.3
  Route15 0.127: v7,20.3 arc-45 7.38,20.56 9.83,20.56 arc-45 11.63,19.81 15.01,16.43 arc-45 15.75,14.64 15.75,8.05 arc34 16.26,6.4 arc-12 16.96,4.81 arc-37 17,3.21 16.91,2.77 arc24 16.91,2.02 TET30.3
N$85  (via drill 0.2)
  Top 0.127: C.58 8.82,18.68 v8.96,18.65
  Route15 0.127: v8.96,18.65 arc-45 9.42,18.84 10.24,18.84 arc-45 12.04,18.1 14.25,15.89 arc-45 14.99,14.1 14.99,6.33 arc21 15.18,5.32 arc-38 15.24,3.61 15.16,3.33 arc-40 TET29.1
N$86  (via drill 0.2)
  Top 0.127: C.57 8.76,18.17 arc-46 9.05,18.23 arc43 9.28,18.27 9.52,18.42 v9.53,18.46
  Route2 0.127: v9.53,18.46 arc-45 9.99,18.65 10.2,18.65 arc-45 12,17.91 14.12,15.79 arc-45 14.86,13.99 14.86,4.28 arc-45 TET29.0
N$87  (via drill 0.2)
  Top 0.127: C.54 9.59,17.27 arc-45 v9.85,17.32
  Route15 0.127: v9.85,17.32 arc-45 10.31,17.51 10.65,17.51 arc-45 12.44,16.76 13.74,15.47 arc-45 14.48,13.67 14.48,6.9 arc-19 13.9,4.07 13.73,3.74 arc-27 13.17,3.09 TET28.1
N$88  (via drill 0.2)
  Top 0.127: C.53 9.67,16.86 arc-46 9.94,16.91 arc43 10.16,16.95 10.41,17.11 v10.42,17.13
  Route2 0.127: TET28.0 arc32 14.35,7.09 14.35,13.55 arc45 13.61,15.35 12.37,16.59 arc45 10.61,17.32 v10.42,17.13
N$89  (via drill 0.2)
  Top 0.127: C.49 10.56,15.53 arc-46 10.75,15.57 10.84,15.55 arc43 10.94,15.57 v11.3,15.79 v11.31,15.79
  Route2 0.127: TET27.0 arc-11 12.96,5.89 arc46 13.85,7.98 13.85,13.1 arc45 13.1,14.9 12.54,15.46 arc45 11.43,15.92 v11.31,15.79
N$90  (via drill 0.2)
  Top 0.127: C.50 10.47,15.93 arc-45 v10.74,15.98
  Route15 0.127: v10.74,15.98 10.85,16.1 arc-45 11.03,16.18 arc-45 12.83,15.43 13.23,15.03 arc-45 13.97,13.23 13.97,7.29 arc-33 13.4,5.95 arc13 12.35,4.22 arc-47 11.93,3.8 TET27.1
N$91  (via drill 0.2)
  Top 0.127: C.46 11.35,14.6 arc-45 v11.62,14.65
  Route15 0.127: v11.62,14.65 arc-45 12.08,14.84 12.09,14.84 arc-45 12.72,14.58 arc-45 13.47,12.79 13.47,9.32 arc-46 12.2,6.33 11.43,5.69 arc30 11,5.06 arc-45 10.5,4.51 TET26.1
N$92  (via drill 0.2)
  Top 0.127: C.45 11.11,13.95 arc17 11.15,13.98 11.28,14.14 arc-31 11.34,14.19 11.5,14.25 arc-22 11.52,14.25 11.71,14.25 arc27 11.76,14.26 12.08,14.42 v12.2,14.46
  Route2 0.127: TET26.0 arc-14 11.94,6.65 arc53 13.34,9.44 13.34,12.65 arc64 v12.2,14.46
N$93  (via drill 0.2)
  Top 0.127: C.42 12.05,13.13 arc-45 v12.32,13.19
  Route15 0.127: v12.32,13.19 12.83,12.69 arc-45 12.96,12.37 12.96,9.83 arc-57 11.75,7.6 arc20 9.85,5.82 arc-44 TET25.1 | v12.32,13.19
N$94  (via drill 0.2)
  Top 0.127: C.41 12.02,12.63 arc-45 v12.26,12.68
  Route2 0.127: v12.26,12.68 12.66,12.28 arc-45 12.83,11.87 12.83,9.95 arc-64 11.43,7.73 arc23 TET25.0
N$95  (via drill 0.2)
  Top 0.127: C.38 11.48,10.82 11.47,10.78 v11,10.46 v10.99,10.46
  Route15 0.127: TET24.1 arc42 8.67,6.75 8.85,6.96 arc-11 9,7.11 10.96,8.72 arc99 v10.99,10.46
N$96  (via drill 0.2)
  Top 0.127: C.37 11.64,10.44 11.62,10.34 11.03,9.94 v10.94,9.92
  Route2 0.127: TET24.0 8.45,7.01 arc31 8.79,7.15 10.91,8.89 arc92 v10.94,9.92
N$193  (via drill 0.2)
  Top 0.127: v31.55,8.53 31.53,8.64 31.17,9.17 arc45 31.12,9.2 31.09,9.21 arc-45 30.98,9.28 B.33
  Route2 0.127: TET39.0 v31.55,8.53
N$194  (via drill 0.2)
  Top 0.127: v31.05,8.68 30.92,8.88 arc45 30.84,8.93 30.78,8.94 arc-45 30.67,9.02 B.32
  Route15 0.127: TET39.1 32.16,6.35 arc-48 31.55,7.07 v31.05,8.68
N$195  (via drill 0.2)
  Top 0.127: v30.61,8.56 v30.61,8.56 arc-45 30.42,8.68 B.31
  Route2 0.127: TET39.2 v30.61,8.56
N$196  (via drill 0.2)
  Top 0.127: v30.17,8.36 30.15,8.37 B.30
  Route15 0.127: TET39.3 31.65,5.88 arc23 31.3,6.7 v30.17,8.36
N$197  (via drill 0.2)
  Top 0.127: B.29 29.9,8.12 arc7 29.92,8.1 30.01,8.01 arc-18 30.06,7.95 v30.22,7.64
  Route2 0.127: TET38.0 v30.22,7.64
N$198  (via drill 0.2)
  Top 0.127: v29.72,7.79 29.58,8 arc45 29.51,8.05 29.45,8.06 arc-45 29.34,8.13 B.28
  Route15 0.127: TET38.1 31,5.36 arc-43 30.32,6.13 v29.72,7.79
N$199  (via drill 0.2)
  Top 0.127: v8.59,31.82 8.61,31.71 8.97,31.18 arc45 9.02,31.15 9.05,31.15 arc-45 9.16,31.08 A.33
  Route2 0.127: TET7.0 v8.59,31.82
N$200  (via drill 0.2)
  Top 0.127: v9.08,31.67 9.22,31.47 arc45 9.29,31.42 9.36,31.41 arc-45 9.46,31.33 A.32
  Route15 0.127: TET7.1 7.97,34 arc-48 8.59,33.28 v9.08,31.67
N$201  (via drill 0.2)
  Top 0.127: v9.53,31.8 v9.53,31.8 arc-45 9.72,31.67 A.31
  Route2 0.127: TET7.2 v9.53,31.8
N$202  (via drill 0.2)
  Top 0.127: v9.97,31.99 9.99,31.98 A.30
  Route15 0.127: TET7.3 8.49,34.47 arc23 8.84,33.65 v9.97,31.99
N$203  (via drill 0.2)
  Top 0.127: A.29 10.23,32.23 arc7 10.22,32.25 10.12,32.35 arc-18 10.09,32.39 v9.92,32.71
  Route2 0.127: TET6.0 v9.92,32.71
N$204  (via drill 0.2)
  Top 0.127: v10.42,32.56 10.56,32.35 arc45 10.63,32.3 10.69,32.29 arc-45 10.8,32.22 A.28
  Route15 0.127: TET6.1 9.14,34.99 arc-43 9.82,34.22 v10.42,32.56
N$205  (via drill 0.2)
  Top 0.127: v10.86,32.68 10.98,32.66 A.27
  Route2 0.127: TET6.2 v10.86,32.68
N$206  (via drill 0.2)
  Top 0.127: v11.31,32.88 11.32,32.87 A.26
  Route15 0.127: TET6.3 9.7,35.81 arc27 10.4,34.12 v11.31,32.88
N$207  (via drill 0.2)
  Top 0.127: v11.25,33.6 11.37,33.3 arc27 11.4,33.27 11.74,32.97 arc-17 11.82,32.87 A.25
  Route2 0.127: TET5.0 v11.25,33.6
N$208  (via drill 0.2)
  Top 0.127: v11.75,33.45 11.93,33.18 arc45 12,33.13 12.04,33.13 arc-45 12.15,33.05 12.4,32.68 A.24
  Route15 0.127: TET5.1 10.45,35.85 arc-38 11.09,35.11 v11.75,33.45
N$209  (via drill 0.2)
  Top 0.127: v12.2,33.57 12.24,33.57 arc-45 12.35,33.49 A.23
  Route2 0.127: TET5.2 v12.2,33.57
N$210  (via drill 0.2)
  Top 0.127: v12.64,33.76 12.65,33.76 A.22
  Route15 0.127: TET5.3 11.06,36.48 arc34 11.57,35.14 v12.64,33.76
N$211  (via drill 0.2)
  Top 0.127: A.21 13.08,33.83 arc14 13.03,33.89 12.83,34.08 arc-17 12.79,34.12 12.62,34.4 v12.59,34.49
  Route2 0.127: v12.59,34.49 TET4.0
N$212  (via drill 0.2)
  Top 0.127: v13.08,34.34 13.26,34.08 arc45 13.36,34.01 arc-45 13.46,33.94 13.71,33.58 A.20
  Route15 0.127: TET4.1 11.86,36.55 arc-32 12.51,35.72 v13.08,34.34
N$213  (via drill 0.2)
  Top 0.127: v13.53,34.46 v13.54,34.46 arc-45 13.7,34.35 A.19
  Route2 0.127: TET4.2 v13.53,34.46
N$214  (via drill 0.2)
  Top 0.127: v13.97,34.65 13.98,34.65 A.18
  Route15 0.127: TET4.3 12.42,37.43 arc48 13.04,35.65 v13.97,34.65
N$215  (via drill 0.2)
  Top 0.127: v13.9,35.32 14.14,35 arc8 14.16,34.97 14.36,34.78 arc-10 14.4,34.73 A.17
  Route2 0.127: TET3.0 v13.9,35.32
N$216  (via drill 0.2)
  Top 0.127: v14.42,35.22 14.58,34.99 arc45 14.63,34.96 arc-45 14.75,34.87 15.02,34.48 A.16
  Route15 0.127: TET3.1 13.29,37.13 arc-20 13.69,36.62 v14.42,35.22
N$217  (via drill 0.2)
  Top 0.127: v14.86,35.35 14.9,35.34 arc-45 15.01,35.27 A.15
  Route2 0.127: TET3.2 v14.86,35.35
N$218  (via drill 0.2)
  Top 0.127: v15.31,35.54 A.14
  Route15 0.127: TET3.3 13.8,37.36 arc49 14.04,36.74 v15.31,35.54
N$219  (via drill 0.2)
  Top 0.127: v15.29,36.25 v15.28,36.24 15.65,35.7 arc45 15.71,35.66 A.13
  Route2 0.127: TET2.0 v15.29,36.25
N$220  (via drill 0.2)
  Top 0.127: v15.74,36.23 15.97,35.9 arc45 16.11,35.81 16.4,35.38 A.12
  Route15 0.127: TET2.1 15.26,37.04 arc-12 15.51,36.67 v15.74,36.23
N$221  (via drill 0.2)
  Top 0.127: v16.22,36.19 16.33,36.17 A.11
  Route2 0.127: TET2.2 15.3,37.39 arc34 15.54,37.07 15.78,36.89 arc-24 15.94,36.71 v16.22,36.19
N$222  (via drill 0.2)
  Top 0.127: v16.64,36.43 A.10
  Route15 0.127: TET2.3 15.32,37.75 arc63 15.63,37.05 v16.64,36.43
N$223  (via drill 0.2)
  Top 0.127: v16.51,37.07 16.63,37.04 arc-45 16.78,36.95 A.9
  Route2 0.127: TET1.0 v16.51,37.07
N$224  (via drill 0.2)
  Top 0.127: A.8 18.14,35.64 v18.1,35.62
  Route15 0.127: TET1.1 v18.1,35.62
N$225  (via drill 0.2)
  Top 0.127: A.7 v18.69,35.54 v18.68,35.53
  Route2 0.127: TET1.2 16.66,38.15 arc27 17.14,37.26 v18.68,35.53
N$226  (via drill 0.2)
  Top 0.127: A.6 v18.83,36.06
  Route15 0.127: TET1.3 16.81,38.23 arc63 17.16,37.31 v18.83,36.06
N$227  (via drill 0.2)
  Top 0.127: A.5 18.39,37.41 arc45 18.11,37.6 v18.06,37.61
  Route2 0.127: TET0.0 v18.06,37.61
N$228  (via drill 0.2)
  Top 0.127: v18.42,37.89 A.4
  Route15 0.127: TET0.1 v18.42,37.89
N$229  (via drill 0.2)
  Top 0.127: v18.86,38.02 arc-45 19.02,37.92 A.3
  Route2 0.127: TET0.2 v18.86,38.02
N$230  (via drill 0.2)
  Top 0.127: v19.31,38.21 v19.31,38.2 A.2
  Route15 0.127: TET0.3 v19.31,38.21
N$231  (via drill 0.2)
  Top 0.127: A.38 10.72,28.76 10.67,28.77 v10.35,29.25 v10.35,29.26
  Route2 0.127: TET8.2 arc45 6.8,33.57 7.72,32.65 arc-45 7.94,32.12 7.94,30.08 arc90 9.97,28.75 v10.35,29.26
N$232  (via drill 0.2)
  Top 0.127: v10.86,29.26 A.39
  Route15 0.127: TET8.1 arc-53 7.05,32.88 7.32,32.67 arc-45 7.69,31.74 7.69,30.14 arc90 10.1,28.37 v10.86,29.26
N$233  (via drill 0.2)
  Top 0.127: v11.37,29.26 11.88,28.51 A.40
  Route2 0.127: TET8.0 7.16,32.33 7.31,32.17 arc-45 7.5,31.73 7.5,30.34 arc90 9.47,28.37 10.25,28.37 arc47 10.75,28.59 v11.37,29.26
N$234  (via drill 0.2)
  Top 0.127: A.41 12.53,28.22 arc-45 v12.58,27.99
  Route15 0.127: v12.58,27.99 arc-45 11.81,27.67 10.23,27.67 arc-100 7.05,31.48 6.3,32.23 arc-45 6.16,32.56 6.16,33.02 arc90 TET9.3
N$235  (via drill 0.2)
  Top 0.127: A.42 13.03,28.2 arc-45 v13.08,27.92
  Route2 0.127: v13.08,27.92 arc-45 12.16,27.54 10.23,27.54 arc-102 7.05,31.48 6.09,32.44 arc39 5.72,32.59 TET9.2
N$236  (via drill 0.2)
  Top 0.127: A.43 13.47,28.26 v13.47,28.24
  Route15 0.127: v13.47,28.24 13.47,27.77 arc-45 12.48,27.41 9.97,27.41 arc-100 6.73,31.16 6.3,31.65 arc59 5.94,31.85 TET9.1
N$237  (via drill 0.2)
  Top 0.127: A.44 13.46,28.99 arc26 v13.78,28.68
  Route2 0.127: v13.78,28.68 13.85,27.92 arc-45 12.33,27.29 9.97,27.29 arc-102 6.54,30.81 arc90 6.16,31.19 TET9.0
N$238  (via drill 0.2)
  Top 0.127: A.45 13.83,29.16 arc40 13.91,29.1 13.95,29.09 arc-47 14.03,29.02 14.13,28.84 arc-28 14.15,28.75 14.14,28.51 arc27 14.17,28.38 14.31,28.1 v14.35,28.05
  Route15 0.127: v14.35,28.05 14.21,27.9 arc-45 12.41,27.16 9.72,27.16 arc-81 6.1,30.27 5.32,31.05 arc-45 5.21,31.32 5.21,31.57 arc45 5.12,31.78 TET10.3
N$239  (via drill 0.2)
  Top 0.127: A.46 14.49,28.89 arc-45 v14.55,28.62
  Route2 0.127: TET10.2 4.81,31.34 arc-45 5.19,31.18 6.1,30.27 arc84 9.72,27.03 12.86,27.03 arc45 14.65,27.78 arc51 14.72,27.97 14.68,28.39 v14.55,28.62
N$240  (via drill 0.2)
  Top 0.127: A.47 14.74,29.23 v14.74,29.19
  Route15 0.127: v14.74,29.19 14.86,28.99 arc-31 14.91,28.82 14.92,27.93 arc-46 14.87,27.79 14.73,27.65 arc-45 12.93,26.91 9.47,26.91 arc-80 5.85,29.95 5.34,30.46 arc45 5.01,30.6 TET10.1
N$241  (via drill 0.2)
  Top 0.127: A.48 14.86,29.78 v14.93,29.7
  Route2 0.127: v14.93,29.7 14.94,29.68 arc-38 15.1,29.23 15.12,27.99 arc-46 15.02,27.76 14.78,27.52 arc-45 12.99,26.78 9.47,26.78 arc-83 5.66,29.71 arc90 5.4,29.97 TET10.0
N$242  (via drill 0.2)
  Top 0.127: A.49 15.36,29.74 arc-45 15.4,29.56 15.4,29.55 arc45 15.45,29.3 v15.69,28.94
  Route15 0.127: v15.69,28.94 15.83,28.71 arc-45 15.64,28.18 14.86,27.4 arc-45 13.06,26.65 9.21,26.65 arc-62 5.27,29 4.39,29.89 arc-45 4.26,30.2 4.26,30.26 arc45 4.17,30.49 TET11.3
N$243  (via drill 0.2)
  Top 0.127: A.50 15.83,29.77 arc-45 v15.88,29.51
  Route2 0.127: TET11.2 3.92,30.01 arc-45 4.51,29.76 5.27,29 arc64 9.21,26.53 13.14,26.53 arc45 14.94,27.27 15.42,27.75 arc45 16.08,29.21 v15.88,29.51
N$244  (via drill 0.2)
  Top 0.127: A.51 16.08,30.12 v16.07,30.08
  Route15 0.127: v16.07,30.08 16.12,29.99 arc-29 16.25,29.58 16.26,29.42 arc-45 15.52,27.63 15.03,27.14 arc-45 13.23,26.4 8.96,26.4 arc-61 5.08,28.68 4.69,29.08 arc49 4.22,29.28 TET11.1
N$245  (via drill 0.2)
  Top 0.127: A.52 16.19,30.67 v16.26,30.59
  Route2 0.127: TET11.0 4.77,28.49 arc64 8.96,26.27 13.3,26.27 arc45 15.1,27.02 15.71,27.62 arc45 16.45,29.42 16.44,30.1 arc38 v16.26,30.59
N$246  (via drill 0.2)
  Top 0.127: A.53 16.7,30.63 arc-45 16.75,30.38 arc45 16.8,30.14 17,29.83 v17.02,29.83
  Route15 0.127: TET12.3 3.1,29.27 4.58,27.8 arc44 8.7,26.14 13.37,26.14 arc45 15.17,26.89 16.71,28.43 arc45 17.16,29.6 v17.02,29.83
N$247  (via drill 0.2)
  Top 0.127: A.54 17.16,30.66 arc-45 v17.21,30.4
  Route2 0.127: TET12.2 3.37,28.61 arc-45 4.03,28.34 4.58,27.8 arc47 8.7,26.02 13.46,26.02 arc45 15.25,26.76 16.66,28.17 arc45 17.4,29.96 17.35,30.17 v17.21,30.4
N$248  (via drill 0.2)
  Top 0.127: A.55 17.41,31 v17.4,30.97
  Route15 0.127: v17.4,30.97 17.44,30.9 arc-28 17.55,30.56 17.59,29.95 arc-45 16.85,28.16 15.33,26.63 arc-45 13.53,25.89 8.45,25.89 arc-40 4.39,27.35 4.03,27.71 arc45 3.59,27.89 TET12.1
N$249  (via drill 0.2)
  Top 0.127: A.56 17.52,31.56 v17.59,31.48
  Route2 0.127: TET12.0 4,27.21 arc42 8.45,25.76 13.62,25.76 arc45 15.41,26.51 17.04,28.13 arc45 17.78,29.93 17.76,31.1 arc38 v17.59,31.48
N$250  (via drill 0.2)
  Top 0.127: A.57 17.99,31.57 arc-45 18.06,31.24 arc45 18.1,31.05 18.32,30.72 v18.36,30.72
  Route15 0.127: TET13.3 3.6,26.67 arc45 3.96,26.53 4.07,26.53 arc24 8.2,25.64 13.72,25.64 arc45 15.52,26.38 17.8,28.67 arc45 18.49,30.43 arc31 18.46,30.55 v18.36,30.72 | TET13.3 | TET13.3
N$251  (via drill 0.2)
  Top 0.127: A.58 18.49,31.54 arc-45 v18.55,31.29
  Route2 0.127: v18.55,31.29 18.6,31.2 arc-27 18.7,30.9 18.74,30.44 arc-45 17.99,28.64 15.6,26.25 arc-45 13.81,25.51 8.2,25.51 arc-28 4.07,26.53 3.96,26.53 arc-45 3.6,26.67 3.47,26.81 arc35 2.63,27.15 TET13.2
N$252  (via drill 0.2)
  Top 0.127: A.59 18.74,31.89 v18.74,31.86
  Route15 0.127: v18.74,31.86 18.75,31.84 arc-29 18.88,31.39 18.93,30.39 arc-45 18.18,28.59 15.72,26.13 arc-45 13.92,25.38 7.94,25.38 arc-16 3.81,26.08 3.49,26.28 arc37 3.08,26.45 TET13.1
N$253  (via drill 0.2)
  Top 0.127: A.60 18.85,32.45 v18.93,32.37
  Route2 0.127: TET13.0 3.75,25.87 arc19 7.94,25.26 14.03,25.26 arc45 15.82,26 18.37,28.55 arc45 19.12,30.35 19.1,31.99 arc39 v18.93,32.37
N$254  (via drill 0.2)
  Top 0.127: A.61 19.31,32.48 arc-45 19.38,32.14 arc45 19.42,31.93 19.63,31.62 v19.69,31.61
  Route15 0.127: TET14.3 2.51,25.68 arc45 3.07,25.45 3.62,25.45 arc9 7.69,25.13 14.14,25.13 arc45 15.94,25.87 19.14,29.07 arc45 19.88,30.86 19.85,31.12 arc26 v19.69,31.61
N$255  (via drill 0.2)
  Top 0.127: A.62 19.54,32.86 arc-45 19.57,32.68 arc45 19.59,32.58 19.86,32.18 v19.88,32.18
  Route2 0.127: TET14.2 arc90 2.03,25.45 3.62,25.45 arc12 7.69,25 14.25,25 arc45 16.04,25.75 19.33,29.03 arc45 20.07,30.82 20.03,31.69 arc29 v19.88,32.18
N$256  (via drill 0.2)
  Top 0.127: A.63 20.06,32.79 arc-45 v20.07,32.75
  Route15 0.127: TET14.1 3.5,24.97 arc3 7.43,24.87 14.33,24.87 arc45 16.12,25.62 19.52,29.01 arc45 20.26,30.81 20.25,32.17 arc31 20.09,32.72 v20.07,32.75
N$257  (via drill 0.2)
  Top 0.127: A.64 20.11,33.43 arc12 v20.26,33.26
  Route2 0.127: v20.26,33.26 arc-31 20.44,32.65 20.45,30.78 arc-45 19.71,28.98 16.22,25.49 arc-45 14.42,24.75 7.43,24.75 arc-6 3.5,24.94 3.34,24.94 arc45 3.01,24.8 TET14.0
N$258  (via drill 0.2)
  Top 0.127: v19.53,35.02 A.65
  Route15 0.127: TET15.3 1.95,24.23 arc45 2.45,23.99 3.31,23.99 arc-17 7.18,24.62 14.52,24.62 arc45 16.32,25.36 20.09,29.13 arc45 20.83,30.93 20.77,32.84 arc35 20.49,33.72 20.4,33.79 arc-21 20.26,33.93 v19.53,35.02
N$259  (via drill 0.2)
  Top 0.127: v20.07,34.91 A.66
  Route2 0.127: TET15.2 arc45 1.56,24.05 3.24,24.05 arc-13 7.18,24.49 14.59,24.49 arc45 16.39,25.24 20.28,29.12 arc45 21.02,30.92 20.76,32.95 arc15 20.54,33.79 v20.07,34.91
N$260  (via drill 0.2)
  Top 0.127: v20.2,35.45 A.67
  Route15 0.127: TET15.1 arc-53 2.22,23.61 3.04,23.61 arc12 3.32,23.63 6.69,24.32 arc-11 7.16,24.37 14.7,24.37 arc45 16.49,25.11 20.47,29.09 arc45 21.21,30.88 21.1,32.96 arc-3 21.09,33.3 21.09,33.6 arc31 21.01,34.17 20.88,34.44 v20.2,35.45
N$261  (via drill 0.2)
  Top 0.127: v20.74,35.41 21.16,34.79 A.68
  Route2 0.127: TET15.0 6.6,24.15 arc-15 7.26,24.24 14.79,24.24 arc45 16.59,24.98 20.72,29.12 arc45 21.36,30.84 21.17,32.65 arc-12 21.11,33.62 21.14,34.29 arc34 20.92,35.13 v20.74,35.41
N$262  (via drill 0.2)
  Top 0.127: v29.28,7.67 29.16,7.69 B.27
  Route2 0.127: TET38.2 v29.28,7.67
N$263  (via drill 0.2)
  Top 0.127: v28.83,7.48 28.82,7.48 B.26
  Route15 0.127: TET38.3 30.44,4.54 arc27 29.74,6.23 v28.83,7.48
N$264  (via drill 0.2)
  Top 0.127: v28.89,6.75 28.76,7.05 arc27 28.74,7.08 28.4,7.38 arc-17 28.31,7.48 B.25
  Route2 0.127: TET37.0 v28.89,6.75
N$265  (via drill 0.2)
  Top 0.127: v28.39,6.9 28.21,7.17 arc45 28.14,7.22 28.1,7.22 arc-45 27.99,7.3 27.74,7.67 B.24
  Route15 0.127: TET37.1 29.69,4.5 arc-38 29.05,5.24 v28.39,6.9
N$266  (via drill 0.2)
  Top 0.127: v27.94,6.78 27.9,6.79 arc-45 27.79,6.86 B.23
  Route2 0.127: TET37.2 v27.94,6.78
N$267  (via drill 0.2)
  Top 0.127: v27.5,6.59 27.49,6.59 B.22
  Route15 0.127: TET37.3 29.08,3.87 arc34 28.57,5.21 v27.5,6.59
N$268  (via drill 0.2)
  Top 0.127: B.21 27.06,6.52 arc14 27.11,6.46 27.31,6.27 arc-17 27.35,6.23 27.52,5.95 v27.55,5.86
  Route2 0.127: v27.55,5.86 TET36.0
N$269  (via drill 0.2)
  Top 0.127: v27.05,6.02 26.88,6.27 arc45 26.78,6.34 arc-45 26.68,6.41 26.43,6.77 B.20
  Route15 0.127: TET36.1 28.28,3.8 arc-32 27.63,4.63 v27.05,6.02
N$270  (via drill 0.2)
  Top 0.127: v26.61,5.89 v26.6,5.89 arc-45 26.44,6 B.19
  Route2 0.127: TET36.2 v26.61,5.89
N$271  (via drill 0.2)
  Top 0.127: v26.17,5.7 26.16,5.7 B.18
  Route15 0.127: TET36.3 27.72,2.92 arc48 27.1,4.7 v26.17,5.7
N$272  (via drill 0.2)
  Top 0.127: v26.24,5.03 26,5.35 arc8 25.98,5.38 25.78,5.57 arc-10 25.74,5.62 B.17
  Route2 0.127: TET35.0 v26.24,5.03
N$273  (via drill 0.2)
  Top 0.127: v25.72,5.13 25.56,5.36 arc45 25.51,5.39 arc-45 25.39,5.48 25.12,5.88 B.16
  Route15 0.127: TET35.1 26.85,3.22 arc-20 26.45,3.74 v25.72,5.13
N$274  (via drill 0.2)
  Top 0.127: v25.28,5 25.24,5.01 arc-45 25.13,5.08 B.15
  Route2 0.127: TET35.2 v25.28,5
N$275  (via drill 0.2)
  Top 0.127: v24.83,4.81 B.14
  Route15 0.127: TET35.3 26.33,2.99 arc49 26.1,3.61 v24.83,4.81
N$276  (via drill 0.2)
  Top 0.127: v24.85,4.1 v24.86,4.11 24.49,4.65 arc45 24.42,4.69 B.13
  Route2 0.127: TET34.0 v24.85,4.1
N$277  (via drill 0.2)
  Top 0.127: B.12 23.74,4.97 24.03,4.54 arc-45 24.17,4.45 24.37,4.17 v24.4,4.12
  Route15 0.127: TET34.1 24.88,3.31 arc-12 24.62,3.68 24.55,3.82 v24.4,4.12
N$278  (via drill 0.2)
  Top 0.127: v23.92,4.16 23.81,4.18 B.11
  Route2 0.127: TET34.2 24.84,2.96 arc34 24.6,3.28 24.36,3.47 arc-24 24.2,3.64 23.94,4.11 v23.92,4.16
N$279  (via drill 0.2)
  Top 0.127: v23.5,3.92 B.10
  Route15 0.127: TET34.3 24.82,2.6 arc63 24.51,3.3 v23.5,3.92
N$280  (via drill 0.2)
  Top 0.127: v23.63,3.28 23.51,3.31 arc-45 23.36,3.4 B.9
  Route2 0.127: TET33.0 v23.63,3.28
N$281  (via drill 0.2)
  Top 0.127: B.8 22,4.71 v22.04,4.73
  Route15 0.127: TET33.1 v22.04,4.73
N$282  (via drill 0.2)
  Top 0.127: B.7 v21.45,4.81 v21.46,4.82
  Route2 0.127: TET33.2 23.48,2.2 arc27 23,3.09 v21.46,4.82
N$283  (via drill 0.2)
  Top 0.127: B.6 v21.31,4.29
  Route15 0.127: TET33.3 23.33,2.12 arc63 22.98,3.04 v21.31,4.29
N$284  (via drill 0.2)
  Top 0.127: B.5 21.74,2.94 arc45 22.03,2.75 v22.07,2.74
  Route2 0.127: TET32.0 v22.07,2.74
N$285  (via drill 0.2)
  Top 0.127: v21.72,2.46 B.4
  Route15 0.127: TET32.1 v21.72,2.46
N$286  (via drill 0.2)
  Top 0.127: v21.28,2.33 arc-45 21.12,2.43 B.3
  Route2 0.127: TET32.2 v21.28,2.33
N$287  (via drill 0.2)
  Top 0.127: B.38 29.42,11.59 29.47,11.58 v29.79,11.11 v29.78,11.1
  Route2 0.127: TET40.2 arc45 33.34,6.78 32.41,7.7 arc-45 32.2,8.23 32.2,10.27 arc90 30.17,11.6 v29.78,11.1
N$288  (via drill 0.2)
  Top 0.127: v29.28,11.1 B.39
  Route15 0.127: TET40.1 arc-53 33.09,7.47 32.82,7.68 arc-45 32.45,8.61 32.45,10.21 arc90 30.04,11.98 v29.28,11.1
N$289  (via drill 0.2)
  Top 0.127: v28.77,11.1 28.26,11.84 B.40
  Route2 0.127: TET40.0 32.98,8.02 32.83,8.18 arc-45 32.64,8.62 32.64,10.02 arc90 30.67,11.98 29.89,11.98 arc47 29.39,11.77 v28.77,11.1
N$290  (via drill 0.2)
  Top 0.127: B.41 27.61,12.13 arc-45 v27.56,12.37
  Route15 0.127: v27.56,12.37 arc-45 28.33,12.68 29.91,12.68 arc-100 33.09,8.87 33.84,8.12 arc-45 33.98,7.79 33.98,7.33 arc90 TET41.3
N$291  (via drill 0.2)
  Top 0.127: B.42 27.11,12.16 arc-45 v27.05,12.43
  Route2 0.127: v27.05,12.43 arc-45 27.97,12.81 29.91,12.81 arc-102 33.09,8.87 34.04,7.91 arc39 34.42,7.76 TET41.2
N$292  (via drill 0.2)
  Top 0.127: B.43 26.67,12.09 v26.67,12.11
  Route15 0.127: v26.67,12.11 26.67,12.58 arc-45 27.66,12.94 30.17,12.94 arc-100 33.4,9.19 33.84,8.71 arc59 34.2,8.5 TET41.1
N$293  (via drill 0.2)
  Top 0.127: B.44 26.68,11.37 arc26 v26.36,11.67
  Route2 0.127: v26.36,11.67 26.29,12.43 arc-45 27.81,13.06 30.17,13.06 arc-102 33.59,9.55 arc90 33.98,9.16 TET41.0
N$294  (via drill 0.2)
  Top 0.127: B.45 26.31,11.19 arc40 26.23,11.25 26.19,11.26 arc-47 26.11,11.33 26.01,11.51 arc-28 25.99,11.6 26,11.84 arc27 25.97,11.97 25.83,12.25 v25.78,12.3
  Route15 0.127: v25.78,12.3 25.93,12.45 arc-45 27.73,13.19 30.42,13.19 arc-81 34.04,10.08 34.82,9.3 arc-45 34.93,9.03 34.93,8.78 arc45 35.02,8.57 TET42.3
N$295  (via drill 0.2)
  Top 0.127: B.46 25.65,11.46 arc-45 v25.59,11.73
  Route2 0.127: TET42.2 35.33,9.01 arc-45 34.95,9.17 34.04,10.08 arc84 30.42,13.32 27.28,13.32 arc45 25.49,12.57 arc51 25.41,12.38 25.46,11.96 v25.59,11.73
N$296  (via drill 0.2)
  Top 0.127: B.47 25.4,11.12 v25.4,11.16
  Route15 0.127: v25.4,11.16 25.28,11.36 arc-31 25.23,11.53 25.21,12.42 arc-46 25.27,12.56 25.41,12.7 arc-45 27.21,13.44 30.67,13.44 arc-80 34.29,10.4 34.8,9.89 arc45 35.13,9.75 TET42.1
N$297  (via drill 0.2)
  Top 0.127: B.48 25.28,10.57 v25.21,10.65
  Route2 0.127: v25.21,10.65 25.2,10.67 arc-38 25.04,11.12 25.02,12.36 arc-46 25.12,12.59 25.36,12.83 arc-45 27.15,13.57 30.67,13.57 arc-83 34.48,10.64 arc90 34.74,10.38 TET42.0
N$298  (via drill 0.2)